# Altium schematic sheet Step Motor driver and Step Motor.SchDoc
size A4
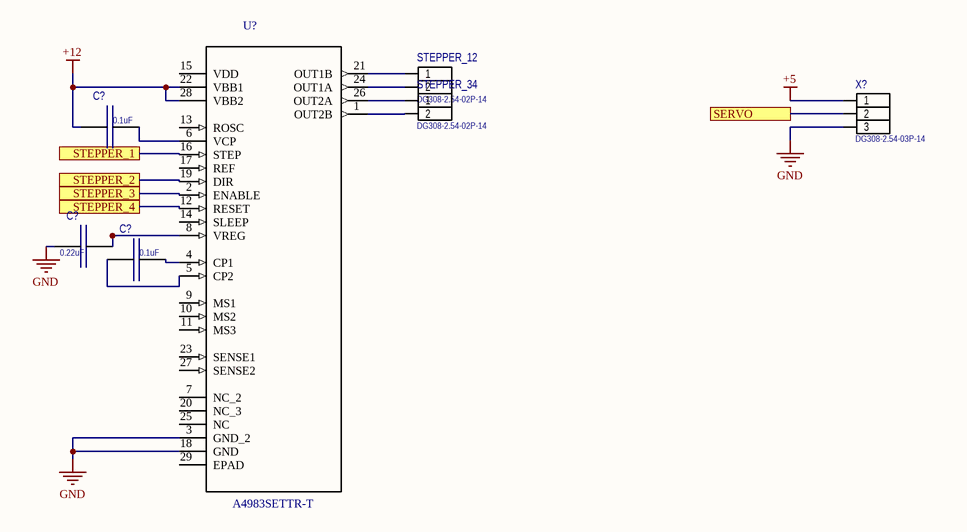
[diagram p0: Step Motor driver and Step Motor.SchDoc]

## Parts
(Parts that share a designator on the sheet are numbered #1, #2 ... from top to bottom, then left to right.)
C?#1  0.1uF  [C_0805]
C?#2  0.22uF  [C_0805]
C?#3  0.1uF  [C_0805]
STEPPER_12  DG308-2.54-02P-14  [DG308-2.54-02P-14]
STEPPER_34  DG308-2.54-02P-14  [DG308-2.54-02P-14]
U?  A4983SETTR-T  [*QFN50P500X500X100-29N]
X?  DG308-2.54-03P-14  [DG308-2.54-03P-14]

## Ports
SERVO, STEPPER_1, STEPPER_2, STEPPER_3, STEPPER_4

## Nets
+5: X?.1
+12: C?#1.1 U?.22(VBB1) U?.28(VBB2)
GND: C?#2.1 U?.3(GND_2) U?.18(GND) X?.3
SERVO: X?.2 ; port SERVO
STEPPER_1: U?.16(STEP) ; port STEPPER_1
STEPPER_2: U?.19(DIR) ; port STEPPER_2
STEPPER_3: U?.2(ENABLE) ; port STEPPER_3
STEPPER_4: U?.12(RESET) ; port STEPPER_4
NetC?#1_2: C?#1.2 U?.6(VCP)
NetC?#2_2: C?#2.2 U?.8(VREG)
NetC?#3_1: C?#3.1 U?.5(CP2)
NetC?#3_2: C?#3.2 U?.4(CP1)
NetSTEPPER_12_1: STEPPER_12.1 U?.21(OUT1B)
NetSTEPPER_12_2: STEPPER_12.2 U?.24(OUT1A)
NetSTEPPER_34_1: STEPPER_34.1 U?.26(OUT2A)
NetSTEPPER_34_2: STEPPER_34.2 U?.1(OUT2B)

Not connected (* = marked no-connect by the designer): U? 7(NC_2) 9(MS1) 10(MS2) 11(MS3) 13(ROSC) 14(SLEEP) 15(VDD) 17(REF) 20(NC_3) 23(SENSE1) 25(NC) 27(SENSE2) 29(EPAD)

## Library data of the parts
C?#1-C?#3 = C0805: Capacitor
  C?#1 C?#3: Value: 0.1uF
  C?#2: Value: 0.22uF
STEPPER_12 STEPPER_34 = DG308-2.54-02P-14: Connector 3Pin 2.54 pitch
U? = A4983SETTR-T: DMOS Stepping Motor Driver 28-Pin QFN EP T/R; MF: Allegro MicroSystems LLC; Package: QFN-28 Allegro MicroSystems LLC; MP: A4983SETTR-T; SnapEDA_Link: https://www.snapeda.com/parts/A4983SETTR-T/Allegro%20MicroSystems%20LLC/view-part/?ref=snap; Availability: Unavailable; Price: None; Value: *
X? = DG308-2.54-03P-14: Connector 3Pin 2.54 pitch